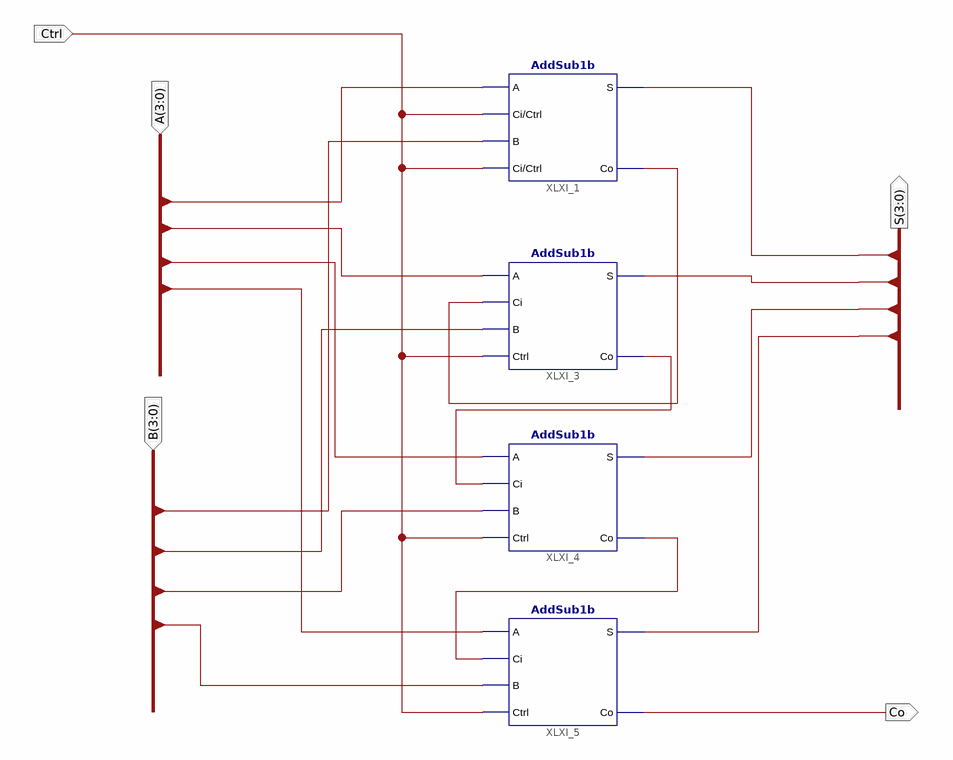
[diagram p0: schematic sheet 1]
// Xilinx ISE schematic AddSub4b.sch (kintex7) as structural Verilog: 4 symbols, 5 ports
module AddSub4b (
  input  [3:0] A,
  input  [3:0] B,
  input  Ctrl,
  output [3:0] S,
  output Co
);

  wire XLXN_16, XLXN_17, XLXN_18;

  AddSub1b XLXI_1 (.A(A[0]), .Ci(Ctrl), .B(B[0]), .Ctrl(Ctrl), .S(S[0]), .Co(XLXN_16));
  AddSub1b XLXI_3 (.A(A[1]), .Ci(XLXN_16), .B(B[1]), .Ctrl(Ctrl), .S(S[1]), .Co(XLXN_17));
  AddSub1b XLXI_4 (.A(A[2]), .Ci(XLXN_17), .B(B[2]), .Ctrl(Ctrl), .S(S[2]), .Co(XLXN_18));
  AddSub1b XLXI_5 (.A(A[3]), .Ci(XLXN_18), .B(B[3]), .Ctrl(Ctrl), .S(S[3]), .Co(Co));
endmodule
